# Altium schematic sheet PCB_BLU1.SchDoc
size A4
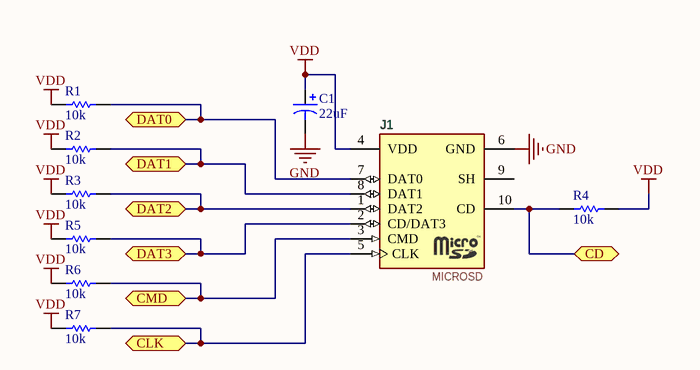
[diagram p0: PCB_BLU1.SchDoc]

## Parts
C1  22uF  [6032]
J1  MICROSD  [MICROSD]
R1  10k  [RES0201R]
R2  10k  [RES0201R]
R3  10k  [RES0201R]
R4  10k  [RES0201R]
R5  10k  [RES0201R]
R6  10k  [RES0201R]
R7  10k  [RES0201R]

## Ports
CD (bidir), CLK (bidir), CMD (bidir), DAT0 (bidir), DAT1 (bidir), DAT2 (bidir), DAT3 (bidir)

## Nets
GND: C1.2 J1.6(GND)
VDD: C1.1 J1.4(VDD) R1.2 R2.2 R3.2 R4.1 R5.2 R6.2 R7.2
CD: J1.10(CD) R4.2 ; port CD
CLK: J1.5(CLK) R7.1 ; port CLK
CMD: J1.3(CMD) R6.1 ; port CMD
DAT0: J1.7(DAT0) R1.1 ; port DAT0
DAT1: J1.8(DAT1) R2.1 ; port DAT1
DAT2: J1.1(DAT2) R3.1 ; port DAT2
DAT3: J1.2(CD/DAT3) R5.1 ; port DAT3

Not connected (* = marked no-connect by the designer): J1 9(SH)

## Library data of the parts
C1 = CWR11DH226M: Tantamount Military, Surface Mount MIL-PRF-55365/8 Qualified Solid Tantalum Chip Capacitor: 22uF, 20% Tolerance, 6 WVDC @ +85°C, Surge = 8V; Note: See Data Sheet for full range of components; Published: 19-Mar-2004; DatasheetDocument: 20-Mar-2003; PackageReference: 6032; Publisher: Altium Limited; Code_JEITA: 6032; ComponentLink1Description: Manufacturer Link; ComponentLink1URL: http://www.vishay.com/; ComponentLink2Description: Datasheet; ComponentLink2URL: http://www.vishay.com/docs/40011/cwr11.pdf; Value: 22uF
J1 = MICROSD: Memory Card Connectors Molex 504528-0892
R1-R7 = Resistor1: Resistor; Value: =Value